# Altium schematic sheet Pneumatics Board.SchDoc
size A
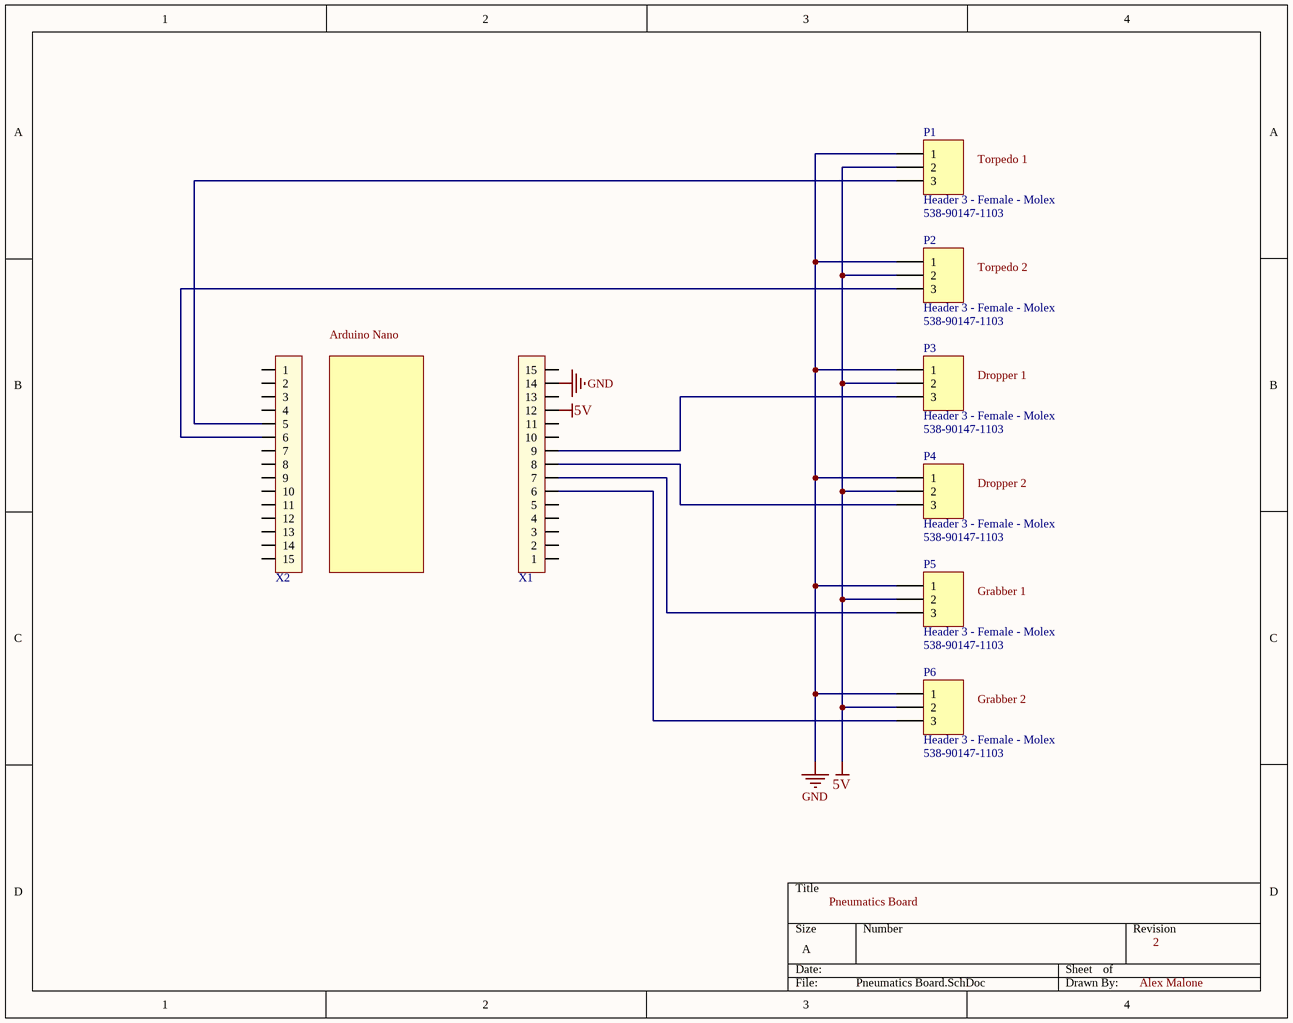
[diagram p0: Pneumatics Board.SchDoc]

## Parts
P1  Header 3 - Female - Molex  Supplier Part Number 1: 538-90147-1103  [HDR1X3 - Female - Molex]
P2  Header 3 - Female - Molex  Supplier Part Number 1: 538-90147-1103  [HDR1X3 - Female - Molex]
P3  Header 3 - Female - Molex  Supplier Part Number 1: 538-90147-1103  [HDR1X3 - Female - Molex]
P4  Header 3 - Female - Molex  Supplier Part Number 1: 538-90147-1103  [HDR1X3 - Female - Molex]
P5  Header 3 - Female - Molex  Supplier Part Number 1: 538-90147-1103  [HDR1X3 - Female - Molex]
P6  Header 3 - Female - Molex  Supplier Part Number 1: 538-90147-1103  [HDR1X3 - Female - Molex]
X1  Header  [1x15 Header]  (value not drawn)
X2  Header  [1x15 Header]  (value not drawn)

## Nets
5V: P1.2 P2.2 P3.2 P4.2 P5.2 P6.2 X1.12
GND: P1.1 P2.1 P3.1 P4.1 P5.1 P6.1 X1.14
NetP1_3: P1.3 X2.5
NetP2_3: P2.3 X2.6
NetP3_3: P3.3 X1.9
NetP4_3: P4.3 X1.8
NetP5_3: P5.3 X1.7
NetP6_3: P6.3 X1.6

Not connected (* = marked no-connect by the designer): X1 1 2 3 4 5 10 11 13 15; X2 1 2 3 4 7 8 9 10 11 12 13 14 15

## Notes on the sheet
- Labels drawn without touching a wire or pin: 2, Alex Malone, Arduino Nano, Dropper 1, Dropper 2, Grabber 1, Grabber 2, Pneumatics Board, Torpedo 1, Torpedo 2

## Library data of the parts
P1-P6 = Header 3 - Female - Molex: Header, 3-Pin; Manufacturer Part Number: 90147-1103; Current Rating: 3 A; Mounting Angle: Vertical; Number of Positions: 3 Position; Voltage Rating: 350 V; Pitch: 2.54 mm; Supplier 1: Mouser; Manufacturer: Molex; RoHS: RoHS Compliant; Category: Headers & Wire Housings; Stock 1: 5207; Pricing 1: 1=1.26, 100=1.09, 500=0.988, 1000=0.895, 2000=0.734, 5000=0.575, 10000=0.490 (AUD); Accessory Type: -; Contact Plating: Tin; Contact Type: -; Housing Material: Polyester; Number of Rows: 1 Row; Packaging: Tube; Product: Headers; Series: 90147; Termination Style: Through Hole; Type: Socket; Brand: Molex; Contact Material: Phosphor Bronze; Mounting Style: Through Hole; Row Spacing: -; Contact Gender: Socket (Female); Housing Gender: -; Product Category: C-Grid Connectors; Standard Pack Qty: 5760; Tradename: C-Grid; RoHS - Mouser: Y; Minimum Order Quantity: 1; Reeling: False; ComponentLink1URL: http://www.mouser.com/ds/2/276/0901471103_PCB_RECEPTACLES-176816.pdf; ComponentLink1Description: http://www.mouser.com/ds/2/276/0901471103_PCB_RECEPTACLES-176816.pdf
X1 X2 = 1x15: 1x3 Header